# EAGLE design fedordesk (EAGLE 6.2)
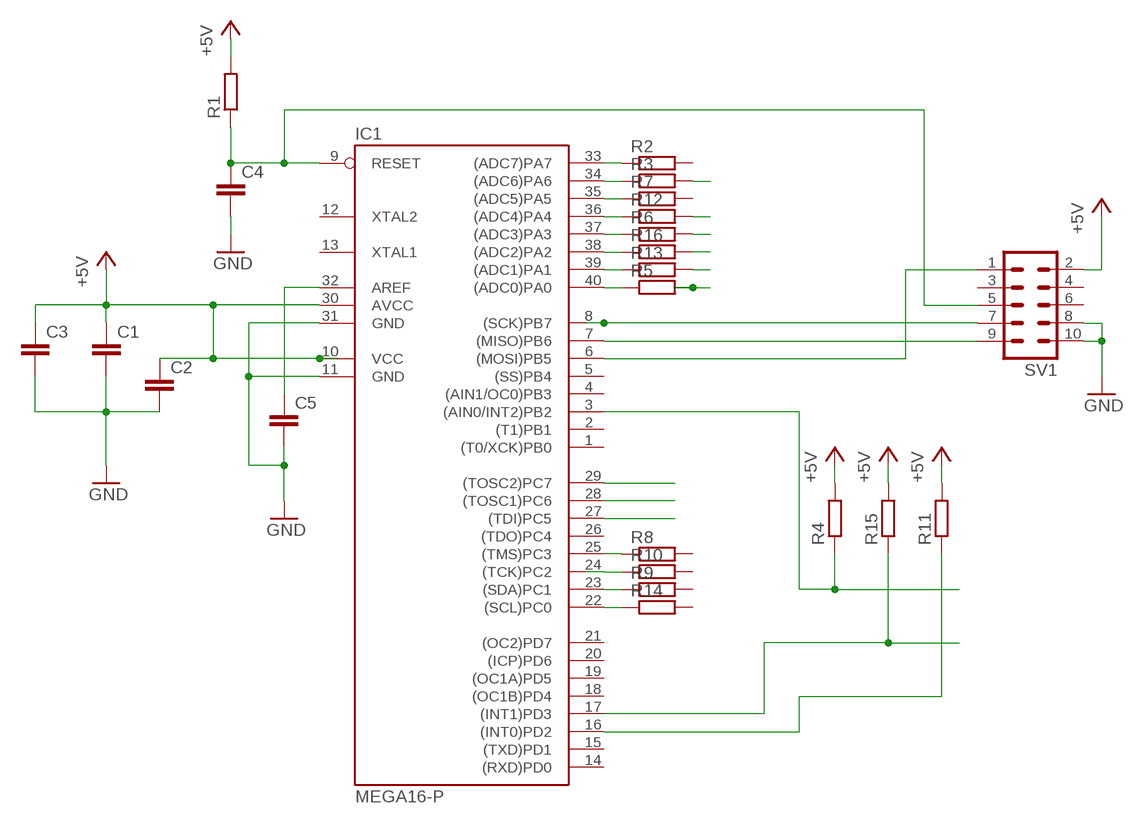
[diagram p0: schematic, sheet 1]

## Parts
C1  C-EU050-024X044  [C050-024X044]
C2  C-EU050-024X044  [C050-024X044]
C3  C-EU050-024X044  [C050-024X044]
C4  C-EU050-024X044  [C050-024X044]
C5  C-EU050-024X044  [C050-024X044]
IC1  MEGA16-P  [DIL40]
R1  R-EU_0207/10  [0207/10]
R2  R-EU_0207/10  [0207/10]
R3  R-EU_0207/10  [0207/10]
R4  R-EU_0207/10  [0207/10]
R5  R-EU_0207/10  [0207/10]
R6  R-EU_0207/10  [0207/10]
R7  R-EU_0207/10  [0207/10]
R8  R-EU_0207/10  [0207/10]
R9  R-EU_0207/10  [0207/10]
R10  R-EU_0207/10  [0207/10]
R11  R-EU_0207/10  [0207/10]
R12  R-EU_0207/10  [0207/10]
R13  R-EU_0207/10  [0207/10]
R14  R-EU_0207/10  [0207/10]
R15  R-EU_0207/10  [0207/10]
R16  R-EU_0207/10  [0207/10]
SV1  ML10L  [ML10L]

## Nets
+5V: C1.1 C2.1 C3.1 IC1.10(VCC) IC1.30(AVCC) R1.2 R4.2 R11.2 R15.2 SV1.2
GND: C1.2 C2.2 C3.2 C4.2 C5.2 IC1.11(GND) IC1.31(GND) SV1.8 SV1.10
N$1: IC1.3((AIN0/INT2)PB2) R4.1
N$2: C5.1 IC1.32(AREF)
N$3: IC1.17((INT1)PD3) R15.1
N$4: IC1.16((INT0)PD2) R11.1
N$5: IC1.6((MOSI)PB5) SV1.1
N$6: C4.1 IC1.9(RESET) R1.1 SV1.5
N$7: IC1.8((SCK)PB7) SV1.7
N$8: IC1.7((MISO)PB6) SV1.9
N$9: IC1.33((ADC7)PA7) R2.1
N$10: IC1.34((ADC6)PA6) R3.1
N$11: IC1.35((ADC5)PA5) R7.1
N$12: IC1.36((ADC4)PA4) R12.1
N$13: IC1.37((ADC3)PA3) R6.1
N$14: IC1.38((ADC2)PA2) R16.1
N$15: IC1.39((ADC1)PA1) R13.1
N$16: IC1.40((ADC0)PA0) R5.1
N$17: R3.2
N$18: IC1.25((TMS)PC3) R8.1
N$19: R12.2
N$20: R6.2
N$21: R16.2
N$22: R13.2
N$23: R5.2
N$24: IC1.23((SDA)PC1) R9.1
N$25: IC1.22((SCL)PC0) R14.1
N$26: IC1.24((TCK)PC2) R10.1
N$28: IC1.28((TOSC1)PC6)
N$30: IC1.29((TOSC2)PC7)
N$31: IC1.27((TDI)PC5)
Unconnected: IC1.1((T0/XCK)PB0) IC1.2((T1)PB1) IC1.4((AIN1/OC0)PB3) IC1.5((SS)PB4) IC1.12(XTAL2) IC1.13(XTAL1) IC1.14((RXD)PD0) IC1.15((TXD)PD1) IC1.18((OC1B)PD4) IC1.19((OC1A)PD5) IC1.20((ICP)PD6) IC1.21((OC2)PD7) IC1.26((TDO)PC4) R2.2 R7.2 R8.2 R9.2 R10.2 R14.2 SV1.3 SV1.4 SV1.6

## Library data of the parts
C1-C5 = rcl:C-EU: CAPACITOR, European symbol
IC1 = atmel:MEGA16-P: MICROCONTROLLER 16 Kbytes FLASH 1 kbytes SRAM 512 bytes EEPROM USART 8-channel 10 bit ADC Source: avr.lbr; MPN: ATMEGA16-16PU; OC_FARNELL: 9171142; OC_NEWARK: 01M6885
R1-R16 = rcl:R-EU_: RESISTOR, European symbol
SV1 = con-ml:ML10L: HARTING; OC_FARNELL: unknown; OC_NEWARK: unknown

## Board
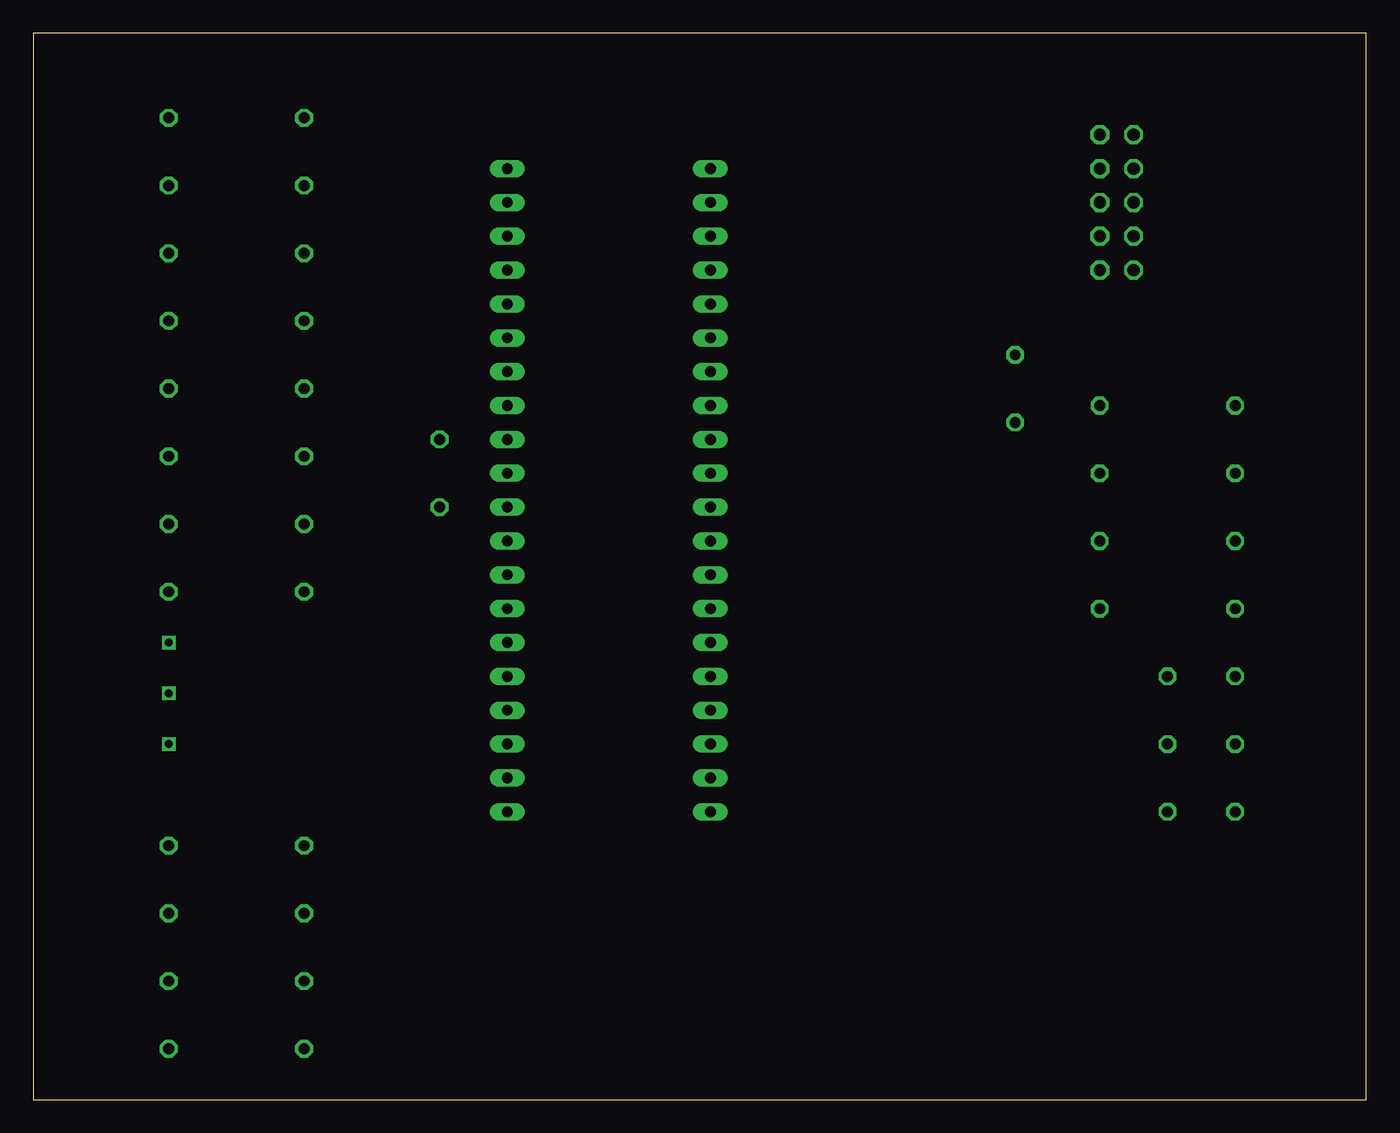
[diagram p1: board, top side]
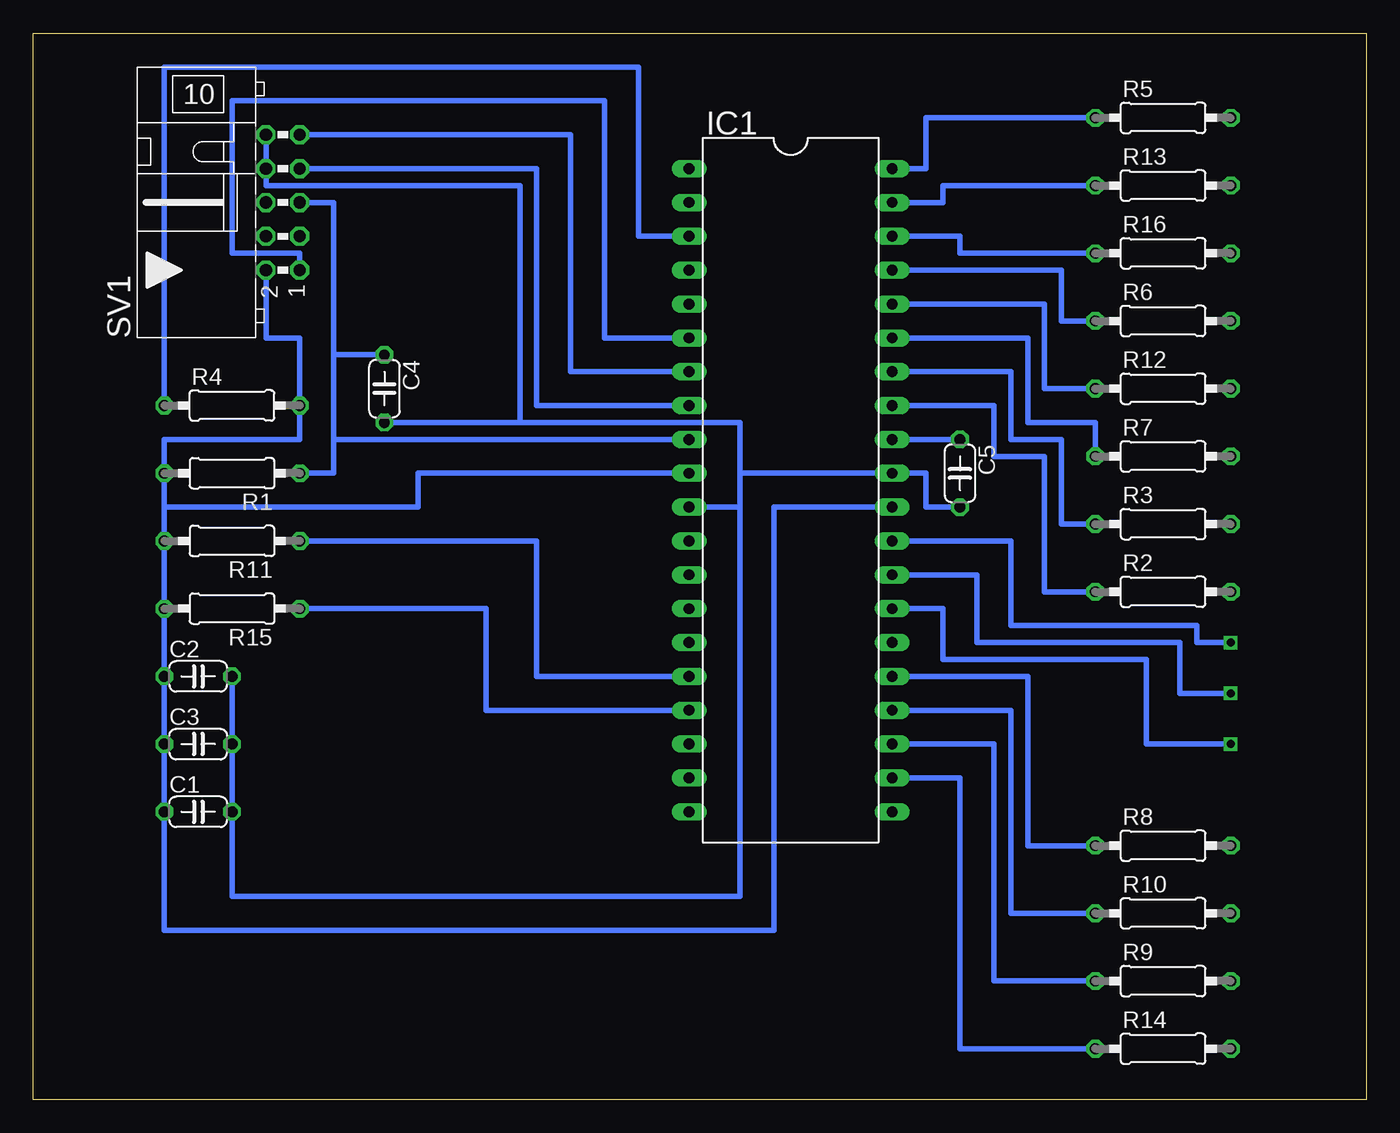
[diagram p2: board, bottom side, seen from below]

Size 100 x 80 mm. Coordinates in mm from the lower left corner, seen from the top.
Outline: 0,0 100,0 100,80 0,80 0,0
Copper layers (1*16): Top 0.035mm / dielectric 1.5mm / Bottom 0.035mm
Design rules: minimum track width 10mil, minimum drill 24mil, track to track 8mil, track to pad 8mil, pad to pad 8mil, via to via 8mil, smd to smd 8mil, copper to edge 40mil, drill to drill 8mil, minimum pad ring 10mil, minimum via ring 8mil, stop-mask expansion 4mil, vias tented up to drill 0mil, thermal gap 10mil

### Footprints (pad centres in the part's own frame; a part is rotated, then mirrored left to right if it is on the bottom)
C050-024X044 = drill 0.813 octagon: 1 -2.54,0; 2 2.54,0
DIL40 = drill 0.813 long: 1 -24.13,-7.62; 2 -21.59,-7.62; 3 -19.05,-7.62; 4 -16.51,-7.62; 5 -13.97,-7.62; 6 -11.43,-7.62; 7 -8.89,-7.62; 8 -6.35,-7.62; 9 -3.81,-7.62; 10 -1.27,-7.62; 11 1.27,-7.62; 12 3.81,-7.62; 13 6.35,-7.62; 14 8.89,-7.62; 15 11.43,-7.62; 16 13.97,-7.62; 17 16.51,-7.62; 18 19.05,-7.62; 19 21.59,-7.62; 20 24.13,-7.62; 21 24.13,7.62; 22 21.59,7.62; 23 19.05,7.62; 24 16.51,7.62; 25 13.97,7.62; 26 11.43,7.62; 27 8.89,7.62; 28 6.35,7.62; 29 3.81,7.62; 30 1.27,7.62; 31 -1.27,7.62; 32 -3.81,7.62; 33 -6.35,7.62; 34 -8.89,7.62; 35 -11.43,7.62; 36 -13.97,7.62; 37 -16.51,7.62; 38 -19.05,7.62; 39 -21.59,7.62; 40 -24.13,7.62
0207/10 = drill 0.813 octagon: 1 -5.08,0; 2 5.08,0
ML10L = drill 0.914 octagon: 1 -5.08,-1.27; 2 -5.08,1.27; 3 -2.54,-1.27; 4 -2.54,1.27; 5 0,-1.27; 6 0,1.27; 7 2.54,-1.27; 8 2.54,1.27; 9 5.08,-1.27; 10 5.08,1.27

### Placement (x,y rotation side)
C1  87.63,21.59 0 bottom
C2  87.63,31.75 0 bottom
C3  87.63,26.67 0 bottom
C4  73.66,53.34 270 bottom
C5  30.48,46.99 270 bottom
IC1  43.18,45.72 270 bottom
R1  85.09,46.99 180 bottom
R2  15.24,38.1 0 bottom
R3  15.24,43.18 0 bottom
R4  85.09,52.07 0 bottom
R5  15.24,73.66 0 bottom
R6  15.24,58.42 0 bottom
R7  15.24,48.26 0 bottom
R8  15.24,19.05 0 bottom
R9  15.24,8.89 0 bottom
R10  15.24,13.97 0 bottom
R11  85.09,41.91 180 bottom
R12  15.24,53.34 0 bottom
R13  15.24,68.58 0 bottom
R14  15.24,3.81 0 bottom
R15  85.09,36.83 180 bottom
R16  15.24,63.5 0 bottom
SV1  81.28,67.31 90 bottom

### Tracks (layer width: path | path; a pad name or v marks a point on that pad's centre or on a via)
+5V
  Bottom 0.406: SV1.2 82.55,57.15 80.01,57.15 R4.2 80.01,49.53 90.17,49.53 R1.2 90.17,44.45 | 90.17,44.45 R11.2 R15.2 C2.1 C3.1 C1.1 90.17,12.7 44.45,12.7 44.45,44.45 IC1.30 | IC1.10 71.12,46.99 71.12,44.45 90.17,44.45
GND
  Bottom 0.406: SV1.10 SV1.8 82.55,68.58 63.5,68.58 63.5,50.8 | 63.5,50.8 46.99,50.8 46.99,46.99 | 46.99,46.99 46.99,44.45 | 46.99,44.45 IC1.11 | C1.2 C3.2 C2.2 85.09,15.24 46.99,15.24 46.99,44.45 | 46.99,46.99 IC1.31 33.02,46.99 33.02,44.45 C5.2 | C4.2 63.5,50.8
N$1
  Bottom 0.406: IC1.3 54.61,64.77 54.61,77.47 90.17,77.47 R4.1
N$2
  Bottom 0.406: C5.1 IC1.32
N$3
  Bottom 0.406: IC1.17 66.04,29.21 66.04,36.83 R15.1
N$4
  Bottom 0.406: R11.1 62.23,41.91 62.23,31.75 IC1.16
N$5
  Bottom 0.406: IC1.6 57.15,57.15 57.15,74.93 85.09,74.93 85.09,63.5 80.01,63.5 SV1.1
N$6
  Bottom 0.406: SV1.5 77.47,67.31 77.47,55.88 | 77.47,55.88 77.47,49.53 | 77.47,49.53 77.47,46.99 R1.1 | IC1.9 77.47,49.53 | C4.1 77.47,55.88
N$7
  Bottom 0.406: IC1.8 62.23,52.07 62.23,69.85 SV1.7
N$8
  Bottom 0.406: IC1.7 59.69,54.61 59.69,72.39 SV1.9
N$9
  Bottom 0.406: IC1.33 27.94,52.07 27.94,48.26 24.13,48.26 24.13,38.1 R2.1
N$10
  Bottom 0.406: R3.1 22.86,43.18 22.86,49.53 26.67,49.53 26.67,54.61 IC1.34
N$11
  Bottom 0.406: R7.1 20.32,50.8 25.4,50.8 25.4,57.15 IC1.35
N$12
  Bottom 0.406: IC1.36 24.13,59.69 24.13,53.34 R12.1
N$13
  Bottom 0.406: R6.1 22.86,58.42 22.86,62.23 IC1.37
N$14
  Bottom 0.406: IC1.38 30.48,64.77 30.48,63.5 R16.1
N$15
  Bottom 0.406: R13.1 31.75,68.58 31.75,67.31 IC1.39
N$16
  Bottom 0.406: IC1.40 33.02,69.85 33.02,73.66 R5.1
N$18
  Bottom 0.406: R8.1 25.4,19.05 25.4,31.75 IC1.25
N$24
  Bottom 0.406: IC1.23 27.94,26.67 27.94,8.89 R9.1
N$25
  Bottom 0.406: R14.1 30.48,3.81 30.48,24.13 IC1.22
N$26
  Bottom 0.406: R10.1 26.67,13.97 26.67,29.21 IC1.24
N$28  (via drill 0.6)
  Bottom 0.406: v10.16,30.48 13.97,30.48 13.97,34.29 29.21,34.29 29.21,39.37 IC1.28
N$30  (via drill 0.6)
  Bottom 0.406: IC1.29 26.67,41.91 26.67,35.56 12.7,35.56 12.7,34.29 v10.16,34.29
N$31  (via drill 0.6)
  Bottom 0.406: v10.16,26.67 16.51,26.67 16.51,33.02 31.75,33.02 31.75,36.83 IC1.27